# EAGLE design vectrex (EAGLE 9.0.1)
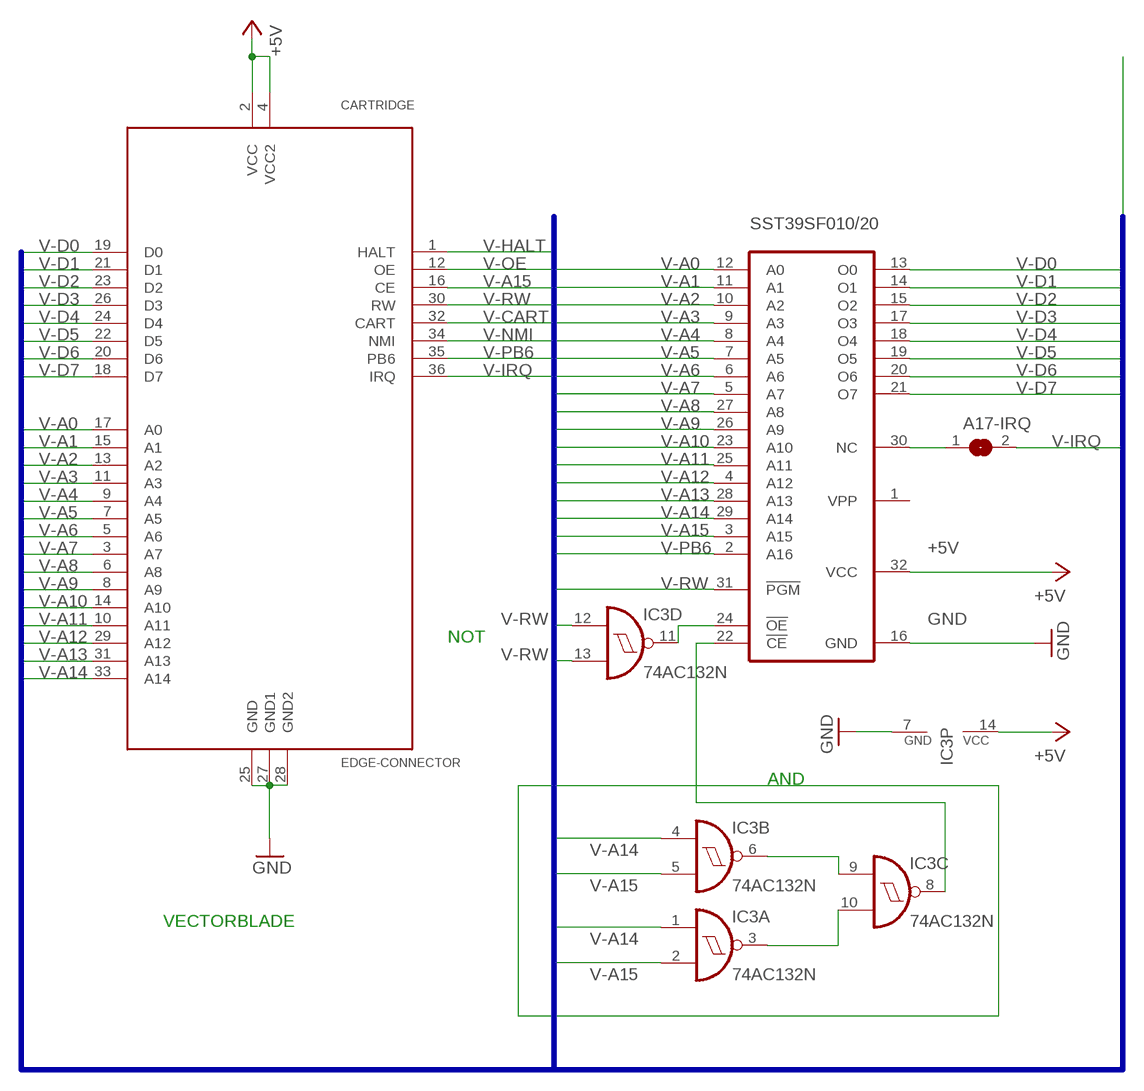
[diagram p0: schematic, sheet 1]

## Parts
A17-IRQ  SJ  [SJ]
CARTRIDGE  EDGE-CONNECTOR  [EDGE-CONNECTOR]
IC3  74AC132N  [DIL14]
SST39SF010/20  27C1001A  [DIL32]

## Nets
+5V: CARTRIDGE.2(VCC) CARTRIDGE.4(VCC2) IC3.14(P:VCC) SST39SF010/20.32(VCC)
GND: CARTRIDGE.25(GND) CARTRIDGE.27(GND1) CARTRIDGE.28(GND2) IC3.7(P:GND) SST39SF010/20.16(GND)
N$1: IC3.8(C:O) SST39SF010/20.22(!CE)
N$2: IC3.6(B:O) IC3.9(C:I0)
N$3: IC3.3(A:O) IC3.10(C:I1)
N$5: IC3.11(D:O) SST39SF010/20.24(!OE)
N$6: A17-IRQ.1 SST39SF010/20.30(NC)
V-A0: CARTRIDGE.17(A0) SST39SF010/20.12(A0)
V-A1: CARTRIDGE.15(A1) SST39SF010/20.11(A1)
V-A2: CARTRIDGE.13(A2) SST39SF010/20.10(A2)
V-A3: CARTRIDGE.11(A3) SST39SF010/20.9(A3)
V-A4: CARTRIDGE.9(A4) SST39SF010/20.8(A4)
V-A5: CARTRIDGE.7(A5) SST39SF010/20.7(A5)
V-A6: CARTRIDGE.5(A6) SST39SF010/20.6(A6)
V-A7: CARTRIDGE.3(A7) SST39SF010/20.5(A7)
V-A8: CARTRIDGE.6(A8) SST39SF010/20.27(A8)
V-A9: CARTRIDGE.8(A9) SST39SF010/20.26(A9)
V-A10: CARTRIDGE.14(A10) SST39SF010/20.23(A10)
V-A11: CARTRIDGE.10(A11) SST39SF010/20.25(A11)
V-A12: CARTRIDGE.29(A12) SST39SF010/20.4(A12)
V-A13: CARTRIDGE.31(A13) SST39SF010/20.28(A13)
V-A14: CARTRIDGE.33(A14) IC3.1(A:I0) IC3.4(B:I0) SST39SF010/20.29(A14)
V-A15: CARTRIDGE.16(CE) IC3.2(A:I1) IC3.5(B:I1) SST39SF010/20.3(A15)
V-CART: CARTRIDGE.32(CART)
V-D0: CARTRIDGE.19(D0) SST39SF010/20.13(O0)
V-D1: CARTRIDGE.21(D1) SST39SF010/20.14(O1)
V-D2: CARTRIDGE.23(D2) SST39SF010/20.15(O2)
V-D3: CARTRIDGE.26(D3) SST39SF010/20.17(O3)
V-D4: CARTRIDGE.24(D4) SST39SF010/20.18(O4)
V-D5: CARTRIDGE.22(D5) SST39SF010/20.19(O5)
V-D6: CARTRIDGE.20(D6) SST39SF010/20.20(O6)
V-D7: CARTRIDGE.18(D7) SST39SF010/20.21(O7)
V-HALT: CARTRIDGE.1(HALT)
V-IRQ: A17-IRQ.2 CARTRIDGE.36(IRQ)
V-NMI: CARTRIDGE.34(NMI)
V-OE: CARTRIDGE.12(OE)
V-PB6: CARTRIDGE.35(PB6) SST39SF010/20.2(A16)
V-RW: CARTRIDGE.30(RW) IC3.12(D:I0) IC3.13(D:I1) SST39SF010/20.31(!PGM)
Unconnected: SST39SF010/20.1(VPP)

## Buses
V-A[0..15],V-CART,V-DIR[0..6],V-D[0..7],V-HALT,V-IRQ,V-NMI,V-OE,V-PB6,V-RW

## Notes on the sheet
- NOT
- AND
- VECTORBLADE

## Library data of the parts
A17-IRQ = jumper:SJ: SMD solder JUMPER
CARTRIDGE = vectrex-cartridge:EDGE-CONNECTOR
IC3 = 74xx-eu:74*132: Quad 2-input NAND schmitt trigger
SST39SF010/20 = memory-nec:27C1001A: MEMORY; MPN: M27C1001-15F1; OC_FARNELL: 1661756; OC_NEWARK: 78M7615; SPICEPREFIX: X

## Board
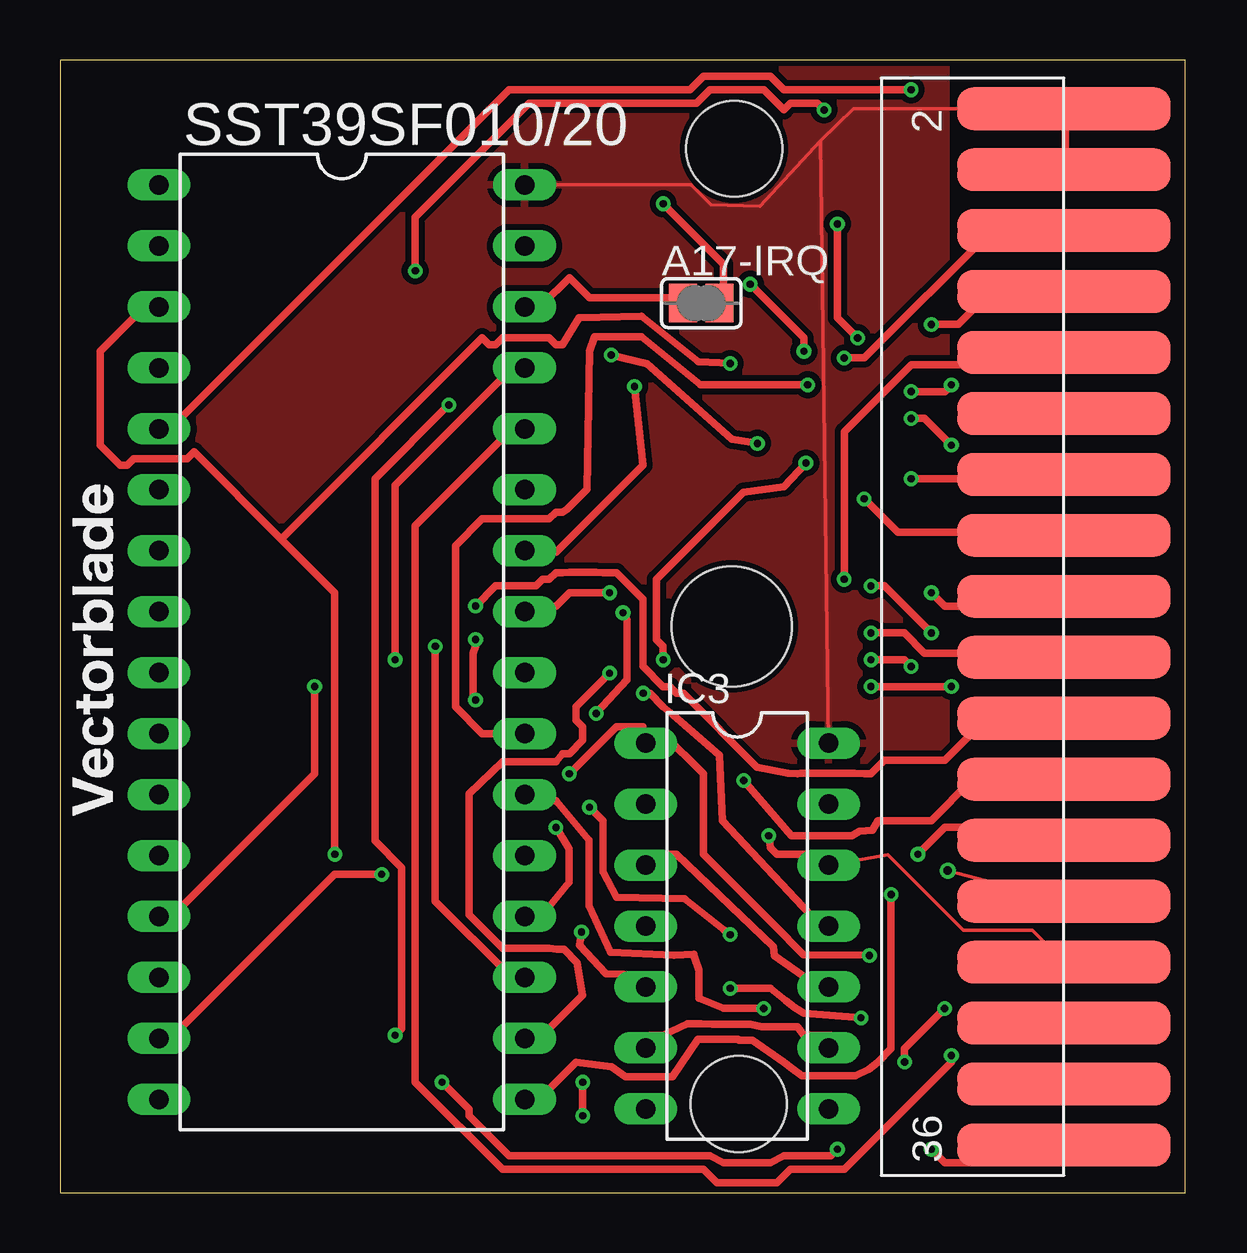
[diagram p1: board, top side]
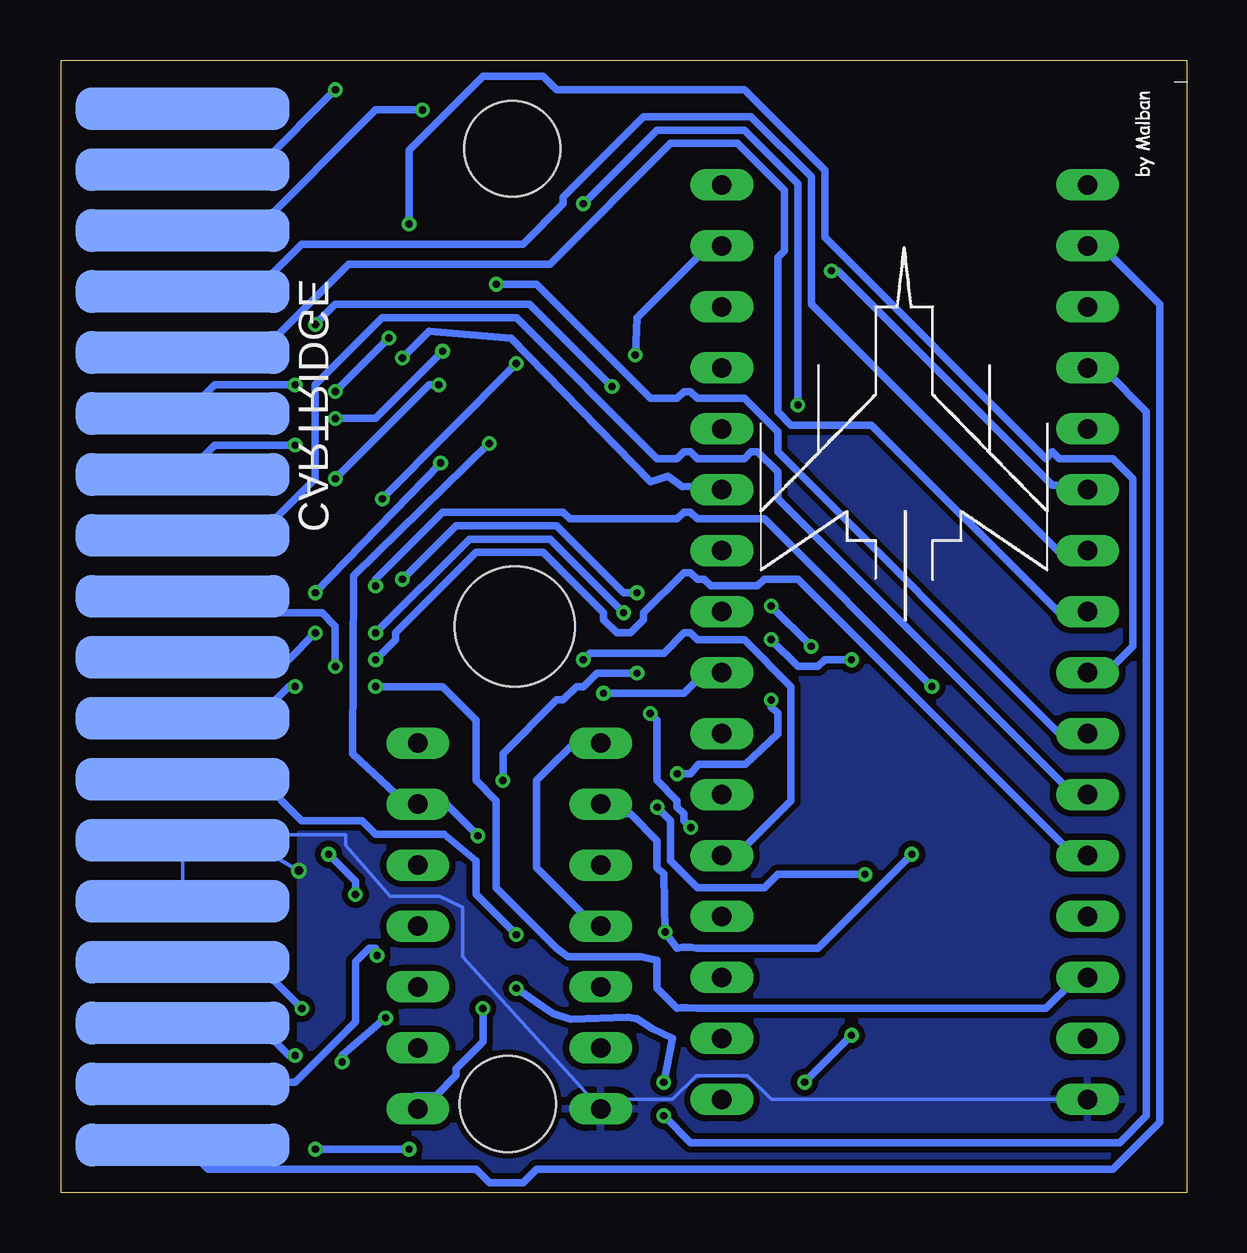
[diagram p2: board, bottom side, seen from below]

Size 46.9 x 47.2 mm. Coordinates in mm from the lower left corner, seen from the top.
Outline: 0,0 46.9,0 46.9,47.2 0,47.2 0,0
Copper layers (1*16): Top 0.035mm / dielectric 1.5mm / Bottom 0.035mm
Design rules "ITead_rule *": minimum track width 12mil, minimum drill 12mil, track to track 10mil, track to pad 10mil, pad to pad 10mil, via to via 10mil, smd to smd 0mil, copper to edge 10mil, drill to drill 10mil, minimum pad ring 10mil, minimum via ring 6mil, stop-mask expansion 2mil, vias tented up to drill 100mil, thermal gap 10mil
Holes 5 mm at 28,23.6
Holes 4 mm at 28.1,43.5 28.3,3.7

### Footprints (pad centres in the part's own frame; a part is rotated, then mirrored left to right if it is on the bottom)
SJ = smd 1.168 x 1.6: 1 -0.762,0; 2 0.762,0
EDGE-CONNECTOR = smd 1.778 x 8.89 bottom: 1 -25.4,0; 3 -22.86,0; 5 -20.32,0; 7 -17.78,0; 9 -15.24,0; 11 -12.7,0; 13 -10.16,0; 15 -7.62,0; 17 -5.08,0; 19 -2.54,0; 21 0,0; 23 2.54,0; 25 5.08,0; 27 7.62,0; 29 10.16,0; 31 12.7,0; 33 15.24,0; 35 17.78,0 | smd 1.778 x 8.89: 2 -25.4,0; 4 -22.86,0; 6 -20.32,0; 8 -17.78,0; 10 -15.24,0; 12 -12.7,0; 14 -10.16,0; 16 -7.62,0; 18 -5.08,0; 20 -2.54,0; 22 0,0; 24 2.54,0; 26 5.08,0; 28 7.62,0; 30 10.16,0; 32 12.7,0; 34 15.24,0; 36 17.78,0
DIL14 = drill 0.813 long: 1 -7.62,-3.81; 2 -5.08,-3.81; 3 -2.54,-3.81; 4 0,-3.81; 5 2.54,-3.81; 6 5.08,-3.81; 7 7.62,-3.81; 8 7.62,3.81; 9 5.08,3.81; 10 2.54,3.81; 11 0,3.81; 12 -2.54,3.81; 13 -5.08,3.81; 14 -7.62,3.81
DIL32 = drill 0.813 long: 1 -19.05,-7.62; 2 -16.51,-7.62; 3 -13.97,-7.62; 4 -11.43,-7.62; 5 -8.89,-7.62; 6 -6.35,-7.62; 7 -3.81,-7.62; 8 -1.27,-7.62; 9 1.27,-7.62; 10 3.81,-7.62; 11 6.35,-7.62; 12 8.89,-7.62; 13 11.43,-7.62; 14 13.97,-7.62; 15 16.51,-7.62; 16 19.05,-7.62; 17 19.05,7.62; 18 16.51,7.62; 19 13.97,7.62; 20 11.43,7.62; 21 8.89,7.62; 22 6.35,7.62; 23 3.81,7.62; 24 1.27,7.62; 25 -1.27,7.62; 26 -3.81,7.62; 27 -6.35,7.62; 28 -8.89,7.62; 29 -11.43,7.62; 30 -13.97,7.62; 31 -16.51,7.62; 32 -19.05,7.62

### Placement (x,y rotation side)
A17-IRQ  26.73,37.07 0 top
CARTRIDGE  41.85,19.77 270 top
IC3  28.23,11.12 270 top
SST39SF010/20  11.75,22.94 270 top

### Tracks (layer width: path | path; a pad name or v marks a point on that pad's centre or on a via)
+5V
  Top 0.152: CARTRIDGE.2 33.07,45.17 31.71,43.83 | 31.71,43.83 29.17,41.12 27.14,41.17 26.31,41.99 SST39SF010/20.32 | IC3.14 31.71,43.83
  Top 0.305: CARTRIDGE.4 41.91,42.89 41.91,45.12 CARTRIDGE.2
  pour Top: 0,0 0,47.2 36.93,47.2 36.93,-0.04
GND  (via drill 0.35)
  Top 0.152: CARTRIDGE.28 v37.01,13.42
  Bottom 0.152: SST39SF010/20.16 17.31,3.89 18.3,4.89 20.44,4.89 21.43,3.89 24.48,3.89 IC3.7 30.18,9.84 30.18,11.9 31.13,12.36 33.19,12.36 35.06,14.48 35.06,14.92 39.98,14.92 40.23,14.67 | CARTRIDGE.25 CARTRIDGE.28 | v37.01,13.42 38.38,14.23
  Bottom 0.305: 40.23,14.67 41.63,14.67 CARTRIDGE.25
  pour Bottom: 0,0 0,47.2 36.93,47.2 36.93,-0.04
N$1  (via drill 0.3)
  Top 0.305: v29.33,7.68 27.66,7.68 26.64,8.12 26.64,9.28 26.45,9.82 26.42,9.93 25.59,9.91 22.94,10.03 22.05,11.97 22.05,14.7 20.67,16.34 19.56,16.34 SST39SF010/20.22
  Bottom 0.305: v29.33,7.68 29.33,6.29 30.45,5.17 30.45,4.89 31.29,4.05 32.13,4.05 IC3.8
N$2
  Top 0.305: IC3.6 24.59,6.56 25.14,6.56 26.16,7.04 26.71,7.04 27.2,7.02 28.78,7.02 29.23,6.91 30.73,6.91 31.01,6.56 32.13,6.56 IC3.9
N$3
  Top 0.305: IC3.3 24.59,14.11 25.7,14.11 29.74,10.25 29.78,9.88 31.17,8.9 32.13,9.08 IC3.10
N$5  (via drill 0.3)
  Top 0.305: v24.31,20.81 24.59,20.81 25.14,20.25 25.58,19.9 27.49,18.22 27.61,15.5 31.29,11.59 32.13,11.59 IC3.11
  Bottom 0.305: v24.31,20.81 20.95,20.81 20.12,21.65 19.56,21.65 SST39SF010/20.24
N$6
  Top 0.305: A17-IRQ.1 25.7,37.3 22.07,37.3 21.23,38.14 20.12,37.02 19.56,37.02 SST39SF010/20.30
V-A0  (via drill 0.3)
  Top 0.305: v33.81,22.21 35.2,22.21 v35.48,21.93
  Bottom 0.305: v33.81,22.21 32.97,23.05 32.97,23.33 29.61,26.68 26.82,26.68 24.31,24.17 24.31,23.89 23.75,23.33 23.19,23.33 22.63,23.89 22.63,24.17 20.95,25.84 20.67,25.84 20.4,25.56 20.12,25.56 19.84,25.28 17.88,25.28 17.6,25.56 16.2,25.56 4.75,14.11 4.19,14.11 SST39SF010/20.12 | v35.48,21.93 35.48,23.61 36.04,24.17 41.07,24.17 41.63,24.72 CARTRIDGE.17
V-A1
  Bottom 0.305: SST39SF010/20.11 4.19,16.62 4.75,16.62 17.04,28.92 17.04,30.03 17.88,30.87 18.16,30.87 18.44,30.59 20.4,30.59 20.67,30.87 20.95,30.87 21.23,30.59 22.07,30.59 27.94,36.46 33.53,36.46 36.32,33.67 36.32,29.75 38.56,27.52 41.63,27.52 CARTRIDGE.15
V-A2  (via drill 0.3)
  Top 0.305: v28.78,37.86 31.01,35.62 v31.01,35.06 | v35.48,32.27 36.04,32.27 v37.16,31.15
  Bottom 0.305: v28.78,37.86 27.1,37.86 22.35,33.11 21.23,33.11 20.95,33.39 20.67,33.39 20.4,33.11 18.44,33.11 17.04,31.71 17.04,30.87 5.31,19.14 4.19,19.14 SST39SF010/20.10 | v31.01,35.06 33.81,32.27 v35.48,32.27 | v37.16,31.15 40.51,31.15 41.63,30.03 CARTRIDGE.13
V-A3  (via drill 0.3)
  Top 0.305: v32.41,40.37 32.41,36.46 v33.25,35.62 | v35.48,33.39 36.88,33.39 v37.16,33.67
  Bottom 0.305: v32.41,40.37 32.41,43.45 29.33,46.52 26.82,46.52 26.26,45.96 18.44,45.96 15.09,42.61 15.09,39.81 5.87,30.59 5.59,30.87 5.31,30.59 3.07,30.59 2.23,29.75 2.23,22.77 3.07,21.93 3.91,21.93 SST39SF010/20.9 | v35.48,33.39 v33.25,35.62 | v37.16,33.67 40.51,33.67 41.63,32.55 CARTRIDGE.11
V-A4
  Bottom 0.305: SST39SF010/20.8 4.19,24.17 5.31,24.17 13.13,31.99 16.48,31.99 17.04,32.55 17.04,38.97 16.76,39.25 16.76,41.77 18.72,43.72 21.51,43.72 26.54,38.7 34.92,38.7 38.56,35.06 41.63,35.06 CARTRIDGE.9
V-A5
  Bottom 0.305: SST39SF010/20.7 4.19,26.68 5.31,26.68 15.65,37.02 15.65,42.33 18.16,44.84 22.63,44.84 25.98,41.49 25.98,41.21 27.66,39.53 36.88,39.53 38.83,37.58 41.63,37.58 CARTRIDGE.7
V-A6  (via drill 0.3)
  Top 0.305: v14.81,38.42 14.81,40.65 19.56,45.4 26.54,45.4 27.1,45.96 29.33,45.96 30.17,45.12 30.45,45.4 31.57,45.4 v31.85,45.12
  Bottom 0.305: v14.81,38.42 14.53,38.42 5.59,29.47 4.19,29.47 SST39SF010/20.6 | v31.85,45.12 33.81,45.12 38.83,40.09 41.63,40.09 CARTRIDGE.5
V-A7  (via drill 0.3)
  Top 0.305: v35.48,45.96 30.17,45.96 29.61,46.52 26.82,46.52 26.26,45.96 18.72,45.96 4.75,31.99 4.19,31.99 SST39SF010/20.5
  Bottom 0.305: v35.48,45.96 38.56,42.89 41.63,42.89 CARTRIDGE.3
V-A8  (via drill 0.3)
  Top 0.305: v32.69,34.78 33.53,34.78 38.83,40.09 CARTRIDGE.6
  Bottom 0.305: v32.69,34.78 31.57,35.9 28.16,35.62 22.35,29.63 21.62,29.86 21.01,29.42 19.56,29.47 SST39SF010/20.27
V-A9  (via drill 0.3)
  Top 0.305: v23.95,33.59 24.31,30.31 20.67,26.68 19.56,26.68 SST39SF010/20.26 | v36.32,36.18 37.44,36.18 38.56,37.3 41.63,37.3 CARTRIDGE.8
  Bottom 0.305: v23.95,33.59 27.38,37.02 35.48,37.02 v36.32,36.18
V-A10  (via drill 0.3)
  Top 0.305: v31.17,33.67 26.7,33.67 24.23,35.67 22.27,35.67 22.07,35.06 21.96,29.32 21.13,28.49 20.95,28.36 20.67,28.36 20.4,28.08 17.6,28.08 16.48,26.96 16.48,20.25 17.6,19.14 19.28,19.14 SST39SF010/20.23 | v35.48,29.75 41.63,29.75 CARTRIDGE.14
  Bottom 0.305: v31.17,33.67 31.57,33.67 v35.48,29.75
V-A11  (via drill 0.3)
  Top 0.305: v22.91,25 21.23,25 20.67,24.45 19.56,24.45 SST39SF010/20.25 | v32.69,25.56 32.69,31.71 35.48,34.5 41.35,34.5 41.63,34.78 CARTRIDGE.10
  Bottom 0.305: v22.91,25 23.47,25 26.26,27.8 30.45,27.8 v32.69,25.56
V-A12  (via drill 0.3)
  Top 0.305: v21.79,4.61 v21.79,3.21 | v27.94,8.52 29.61,8.52 30.26,8 30.63,7.71 31.01,7.49 v33.39,7.29 | v35.2,5.45 35.2,6 v36.88,7.68
  Bottom 0.305: v21.79,3.21 20.67,2.09 2.79,2.09 1.67,3.21 1.67,32.55 3.35,34.22 3.91,34.22 SST39SF010/20.4 | v21.79,4.61 21.44,6.43 22.27,6.84 22.9,7.25 23.29,7.31 25.69,7.24 26.39,7.46 26.56,7.56 27.15,7.98 v27.94,8.52 | v33.39,7.29 35.2,5.73 v35.2,5.45 | v36.88,7.68 38.56,9.36 41.63,9.36 CARTRIDGE.29
V-A13  (via drill 0.3)
  Top 0.305: v37.16,5.73 37.16,5.45 32.69,0.98 30.45,0.98 29.89,0.42 27.38,0.42 26.82,0.98 18.44,0.98 14.81,4.61 14.81,27.8 18.72,31.71 19.28,31.71 SST39SF010/20.28
  Bottom 0.305: v37.16,5.73 37.44,5.73 38.56,6.84 41.63,6.84 CARTRIDGE.31
V-A14  (via drill 0.3)
  Top 0.305: v13.97,22.21 13.97,29.47 18.72,34.22 19.28,34.22 SST39SF010/20.29 | v17.32,23.05 17.32,22.77 17.22,22.49 17.22,20.81 v17.32,20.53 | v21.23,17.46 23.19,19.42 24.31,19.42 IC3.1 24.59,19.14 25.14,19.14 26.82,17.46 26.82,14.11 30.17,10.75 30.56,10.36 30.99,9.92 v33.74,9.89
  Bottom 0.305: IC3.4 24.59,11.59 25.14,11.59 27.1,13.55 27.1,17.18 25.14,19.14 24.59,19.14 IC3.1 | v13.97,22.21 15.09,22.21 15.37,21.93 16.2,21.93 v17.32,23.05 | v17.32,20.53 17.32,20.25 17.04,19.98 17.04,19.14 18.38,17.85 20.34,17.85 20.67,17.46 v21.23,17.46 | v33.74,9.89 33.81,10.2 34.08,10.2 34.64,9.64 34.64,7.12 37.16,4.61 41.63,4.61 CARTRIDGE.33
V-A15  (via drill 0.3)
  Top 0.305: v21.74,10.86 21.66,10.31 22.77,9.13 24.31,9.08 IC3.5 | 9.22,27.24 11.45,25 v11.45,14.11 | 9.22,27.24 5.59,30.87 5.31,30.59 3.07,30.59 2.79,30.31 2.51,30.31 1.67,31.15 1.67,35.06 3.35,36.74 3.91,36.74 SST39SF010/20.3 | v33.53,28.92 34.92,27.52 41.63,27.52 CARTRIDGE.16 | v27.94,34.56 26.61,34.63 24.23,36.53 21.64,36.46 20.95,35.34 20.67,35.34 20.4,35.62 18.44,35.62 18.16,35.34 17.88,35.34 17.6,35.62 9.22,27.24
  Bottom 0.305: IC3.2 24.31,16.62 23.47,15.78 23.19,15.78 22.07,14.67 22.07,13.55 21.79,13.27 v21.74,10.86 21.23,10.2 20.99,10.23 20.71,10.23 20.4,10.2 15.37,10.2 v11.45,14.11 | v27.94,34.56 v33.53,28.92
V-D0  (via drill 0.3)
  Top 0.305: v10.62,21.09 10.62,17.46 4.75,11.59 4.19,11.59 SST39SF010/20.13 | v33.81,25.28 34.36,25.28 v36.32,23.33
  Bottom 0.305: v10.62,21.09 17.6,28.08 20.4,28.08 20.67,28.36 20.95,28.36 21.23,28.08 25.7,28.08 25.98,28.36 31.01,28.36 33.81,25.56 v33.81,25.28 | v36.32,23.33 37.44,22.21 41.63,22.21 CARTRIDGE.19
V-D1  (via drill 0.3)
  Top 0.305: v37.16,21.09 v33.81,21.09
  Bottom 0.305: v33.81,21.09 31.01,21.09 29.61,19.7 29.61,17.18 28.78,16.34 28.78,12.71 26.26,10.2 25.79,9.84 22.75,9.84 22.07,9.69 22.07,8.52 21.23,7.68 21.08,7.71 20.8,7.71 20.4,7.68 5.87,7.68 4.75,8.8 4.19,8.8 SST39SF010/20.14 | v37.16,21.09 37.44,21.09 38.56,19.98 41.63,19.98 CARTRIDGE.21
V-D2  (via drill 0.3)
  Top 0.305: v13.41,13.27 11.45,13.27 4.75,6.56 4.19,6.56 SST39SF010/20.15 | v22.07,16.06 22.63,15.5 22.63,13.37 23.19,12.32 26.04,12.24 27.69,10.95 v27.94,10.75
  Bottom 0.305: v13.41,13.27 17.04,13.27 17.6,12.71 20.4,12.71 21.51,13.83 21.51,15.5 v22.07,16.06 | v27.94,10.75 29.61,12.43 29.61,13.83 30.96,14.94 33.19,14.94 33.53,14.95 33.81,14.95 34.36,15.5 36.88,15.5 38.56,17.18 41.63,17.18 CARTRIDGE.23
V-D3  (via drill 0.3)
  Top 0.305: v34.64,12.43 34.64,6 34.08,5.45 33.72,5.14 33.16,4.88 30.92,4.88 30.54,5.16 30.17,5.45 28.86,6.36 28.3,6.36 28.27,6.4 26.59,6.4 25.53,4.83 23.58,4.83 22.99,5.25 21.51,5.45 20.12,4.05 19.56,4.05 SST39SF010/20.17 | v35.76,14.11 36.88,15.23 41.35,15.23 41.63,14.95 CARTRIDGE.26
  Bottom 0.305: v34.64,12.43 34.64,12.99 v35.76,14.11
V-D4  (via drill 0.3)
  Top 0.305: v22.91,21.65 21.51,20.25 21.51,19.7 21.79,19.42 21.79,18.86 21.23,18.3 20.95,18.3 20.67,17.97 18.44,17.97 17.04,16.62 17.04,11.59 18.44,10.2 20.4,10.2 20.73,10.14 21.01,10.14 21.54,9.58 21.79,8.24 20.12,6.56 19.56,6.56 SST39SF010/20.18 | v28.5,17.18 30.49,14.87 33,14.87 33.33,15.07 33.86,15.11 34.08,15.5 36.32,15.5 38,17.18 41.63,17.18 CARTRIDGE.24
  Bottom 0.305: v22.91,21.65 24.59,21.65 25.14,21.09 25.42,21.09 25.98,20.53 26.26,20.53 28.5,18.3 v28.5,17.18
V-D5  (via drill 0.3)
  Top 0.305: v15.65,22.77 15.65,12.15 18.72,9.08 19.28,9.08 SST39SF010/20.19 | v17.32,24.45 18.16,25.28 19.84,25.28 20.12,25.56 20.4,25.56 20.67,25.84 20.95,25.84 21.23,25.85 22.35,25.85 22.63,25.84 23.19,25.84 24.31,24.72 24.31,21.93 25.14,21.09 25.42,21.09 25.7,20.81 25.98,20.81 29.06,17.74 30.35,17.49 30.73,17.46 30.87,17.49 33.11,17.49 33.53,17.46 33.81,17.46 34.36,18.02 36.88,18.02 38.56,19.7 41.63,19.7 CARTRIDGE.22
  Bottom 0.305: v17.32,24.45 v15.65,22.77
V-D6  (via drill 0.3)
  Top 0.305: v20.67,15.23 21.23,14.33 21.23,12.94 20.12,11.59 19.56,11.59 SST39SF010/20.20 | v22.35,19.98 23.64,21.37 23.64,23.89 v23.47,24.17 | v33.81,23.33 35.2,23.33 36.04,22.49 41.63,22.49 CARTRIDGE.20
  Bottom 0.305: v20.67,15.23 20.95,15.5 20.95,15.78 21.23,16.06 21.23,16.34 22.07,17.18 22.07,19.7 v22.35,19.98 | v23.47,24.17 26.54,27.24 29.89,27.24 v33.81,23.33
V-D7  (via drill 0.3)
  Top 0.305: v25.14,22.21 25.14,22.77 24.87,23.05 24.87,25.56 28.5,29.2 30.17,29.43 v31.1,30.41 | v36.32,25 36.88,24.45 41.35,24.45 41.63,24.72 CARTRIDGE.18
  Bottom 0.305: v25.14,22.21 24.87,22.49 21.79,22.49 20.95,23.33 20.67,23.33 20.4,23.05 18.44,23.05 16.48,21.09 16.48,16.34 18.72,14.11 19.28,14.11 SST39SF010/20.21 | v36.32,25 v31.1,30.41
V-IRQ  (via drill 0.3)
  Top 0.305: v25.14,41.21 27.66,38.7 27.66,37.3 A17-IRQ.2 | v16.2,32.83 13.13,29.75 13.13,14.67 14.25,13.55 14.25,6.84 v13.97,6.56 | v15.92,4.61 17.04,3.49 17.04,3.21 18.72,1.54 27.1,1.54 27.66,1.24 29.61,1.24 30.17,1.54 32.13,1.54 v32.41,1.81 | v36.32,1.81 36.88,1.26 41.07,1.26 41.63,1.81 CARTRIDGE.36
  Bottom 0.305: v25.14,41.21 22.07,44.28 18.44,44.28 16.2,42.05 v16.2,32.83 | v15.92,4.61 v13.97,6.56 | v36.32,1.81 v32.41,1.81
V-PB6
  Bottom 0.305: SST39SF010/20.2 3.91,39.25 3.35,39.25 1.12,37.02 1.12,2.93 3.07,0.98 27.1,0.98 27.66,0.42 29.06,0.42 29.61,0.98 40.79,0.98 41.63,1.81 CARTRIDGE.35
V-RW  (via drill 0.3)
  Top 0.152: CARTRIDGE.30 40.53,10.93 37.66,10.93 34.51,14.08 IC3.12
  Top 0.305: v22.98,34.91 24.48,34.55 28,31.4 v29.07,31.22 | v29.54,14.88 29.61,14.39 29.89,14.11 32.13,14.11 IC3.12
  Bottom 0.305: v22.98,34.91 22.91,36.46 20.12,39.25 19.56,39.25 SST39SF010/20.31 | v29.07,31.22 34.72,25.71 34.77,18.3 32.97,16.62 IC3.13 31.29,16.62 v29.54,14.88